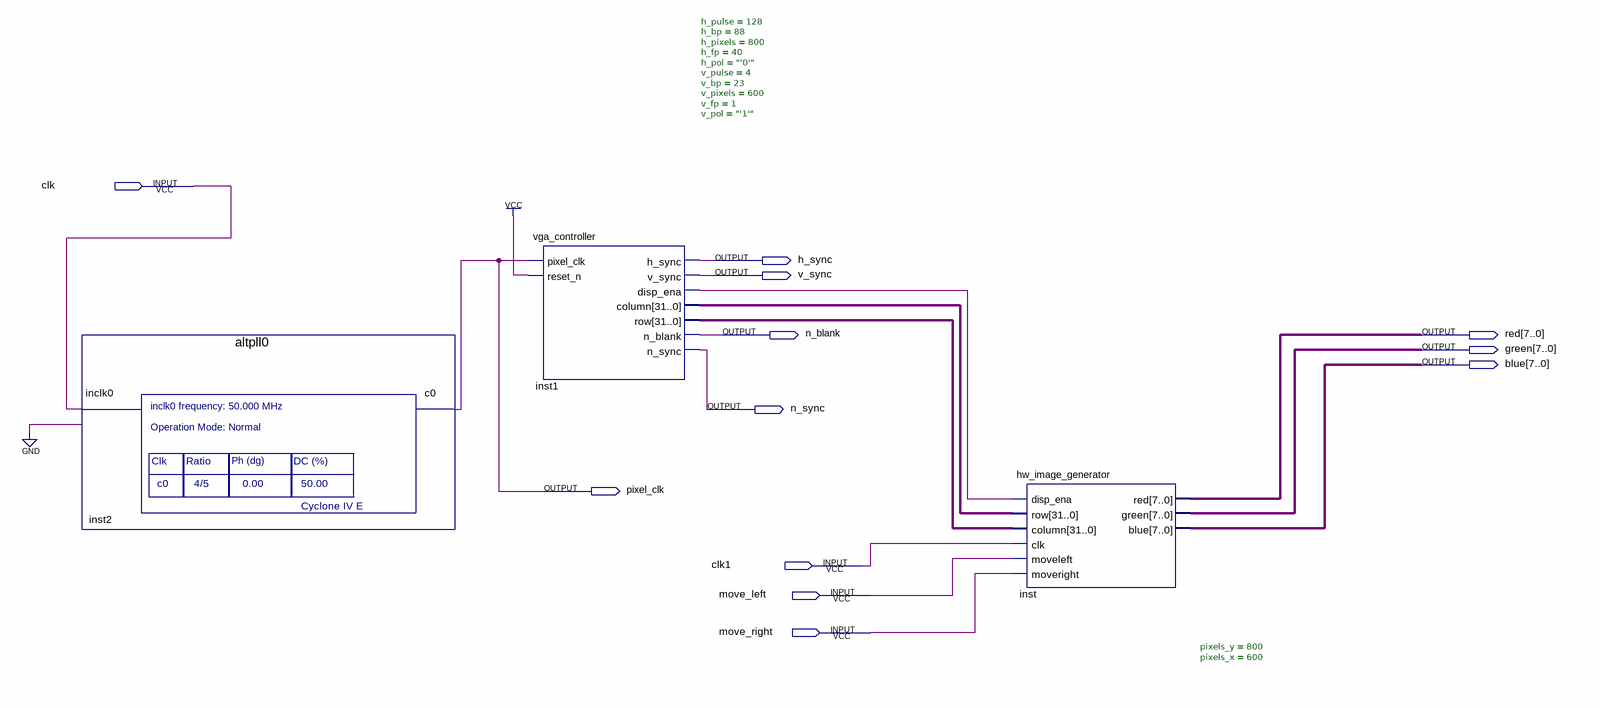
[diagram p0: schematic sheet]
// Quartus schematic vga_with_hw_test_image.bdf as structural Verilog: 3 symbols, 12 pins
module vga_with_hw_test_image (
  input  clk,
  input  clk1,
  input  move_left,
  input  move_right,
  output h_sync,
  output v_sync,
  output n_blank,
  output [7:0] red,
  output [7:0] green,
  output [7:0] blue,
  output n_sync,
  output pixel_clk
);

  wire inst1_disp_ena;
  wire [31:0] inst1_column, inst1_row;

  altpll0 inst2 (.inclk0(clk), .c0(pixel_clk));
  vga_controller #(.h_pulse(128), .h_bp(88), .h_pixels(800), .h_fp(40), .h_pol("'0'"), .v_pulse(4), .v_bp(23), .v_pixels(600), .v_fp(1), .v_pol("'1'")) inst1 (
    .pixel_clk(pixel_clk), .reset_n(1'b1), .h_sync(h_sync), .v_sync(v_sync), .disp_ena(inst1_disp_ena),
    .column(inst1_column), .row(inst1_row), .n_blank(n_blank), .n_sync(n_sync));
  hw_image_generator #(.pixels_y(800), .pixels_x(600)) inst (
    .disp_ena(inst1_disp_ena), .row(inst1_column), .column(inst1_row), .clk(clk1), .moveleft(move_left),
    .moveright(move_right), .red(red), .green(green), .blue(blue));
endmodule
